# EasyEDA schematic SCH_Left-hand_2023-03-17.json
TITLE: Left-hand Detection; REV: 1.0; Date: 2023-03-17; Sheet: 1/1; Drawn By: rjuna; Company: Augmented Guitar
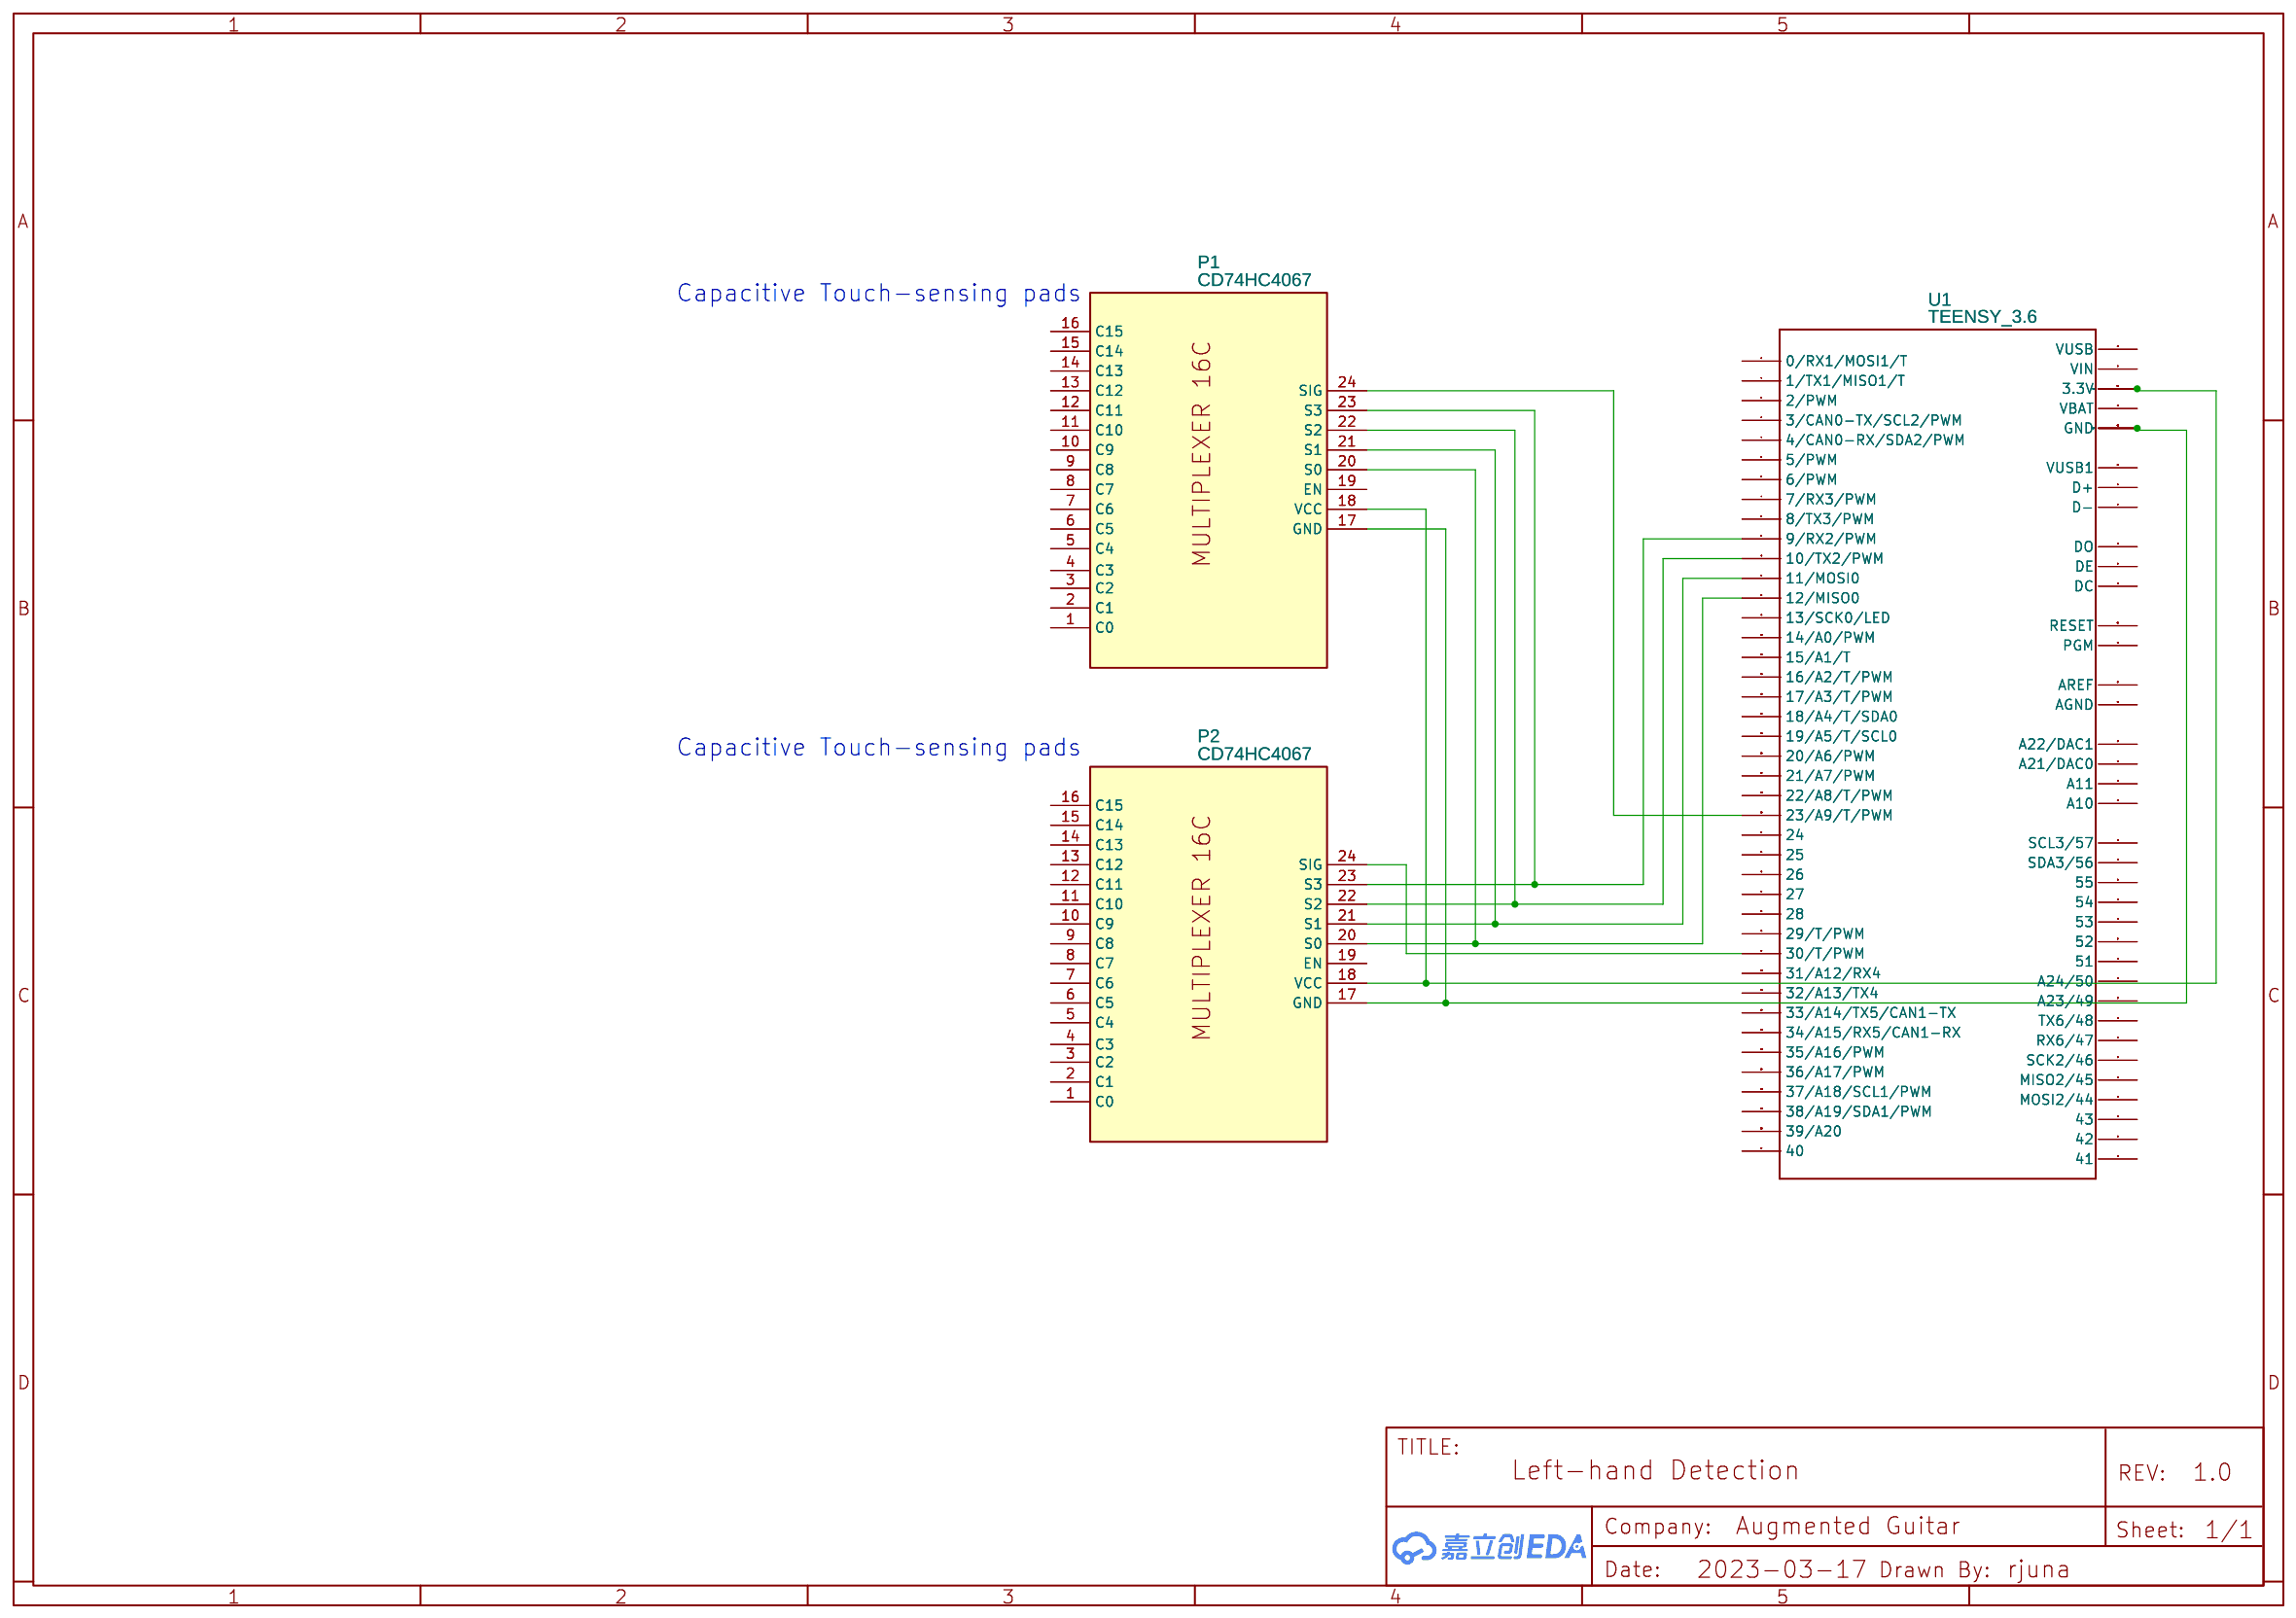
[diagram p0: schematic sheet]

## Parts
P1  CD74HC4067  [CD74HC4067]
P2  CD74HC4067  [CD74HC4067]
U1  TEENSY_3.6  [TEENSY_3_AND_LC_SERIES_BOARDS_V1.4_TEENSY_3.6_ALL_PINS&PADS]

## Library data of the parts
P1 P2 = CD74HC4067: sourceId: 1T5FDZYC8; Supplier: Lolin and Amica; Contributor: PrintplaatEDA
U1 = TEENSY_3.6: Contributor: ByronAP

## Nets
Net-(P1-17): P1.17(GND) P2.17(GND) U1.GND U1.GND1(GND) U1.GND2(GND) U1.GND3(GND) U1.GND4(GND) U1.GND5(GND) U1.GND6(GND)
Net-(P1-18): P1.18(VCC) P2.18(VCC) U1.3.3V U1.3.3V2(3.3V) U1.3.3V3(3.3V) U1.3.3V4(3.3V)
Net-(P1-20): P1.20(S0) P2.20(S0) U1.12(12/MISO0)
Net-(P1-21): P1.21(S1) P2.21(S1) U1.11(11/MOSI0)
Net-(P1-22): P1.22(S2) P2.22(S2) U1.10(10/TX2/PWM)
Net-(P1-23): P1.23(S3) P2.23(S3) U1.9(9/RX2/PWM)
Net-(P1-24): P1.24(SIG) U1.23/A9(23/A9/T/PWM)
Net-(P2-24): P2.24(SIG) U1.30(30/T/PWM)

Not connected (* = marked no-connect by the designer): P1 1(C0) 2(C1) 3(C2) 4(C3) 5(C4) 6(C5) 7(C6) 8(C7) 9(C8) 10(C9) 11(C10) 12(C11) 13(C12) 14(C13) 15(C14) 16(C15) 19(EN); P2 1(C0) 2(C1) 3(C2) 4(C3) 5(C4) 6(C5) 7(C6) 8(C7) 9(C8) 10(C9) 11(C10) 12(C11) 13(C12) 14(C13) 15(C14) 16(C15) 19(EN); U1 0(0/RX1/MOSI1/T) 1(1/TX1/MISO1/T) 2(2/PWM) 3(3/CAN0-TX/SCL2/PWM) 4(4/CAN0-RX/SDA2/PWM) 5(5/PWM) 6(6/PWM) 7(7/RX3/PWM) 8(8/TX3/PWM) 13(13/SCK0/LED) 14/A0(14/A0/PWM) 15/A1(15/A1/T) 16/A2(16/A2/T/PWM) 17/A3(17/A3/T/PWM) 18/A4(18/A4/T/SDA0) 19/A5(19/A5/T/SCL0) 20/A6(20/A6/PWM) 21/A7(21/A7/PWM) 22/A8(22/A8/T/PWM) 24 25 26 27 28 29(29/T/PWM) 31/A12(31/A12/RX4) 32/A13(32/A13/TX4) 33/A14(33/A14/TX5/CAN1-TX) 34/A15(34/A15/RX5/CAN1-RX) 35/A16(35/A16/PWM) 36/A17(36/A17/PWM) 37/A18(37/A18/SCL1/PWM) 38/A19(38/A19/SDA1/PWM) 39/A20 40 41 42 43 44(MOSI2/44) 45(MISO2/45) 46(SCK2/46) 47(RX6/47) 48(TX6/48) 49(A23/49) 50(A24/50) 51 52 53 54 55 56(SDA3/56) 57(SCL3/57) A10 A11 A21(A21/DAC0) A22(A22/DAC1) AGND AREF D+ D- DC DE DO PGM RESET VBAT VIN VUSB VUSB1

## Notes on the sheet
- Capacitive Touch-sensing pads
- Capacitive Touch-sensing pads
